# Altium schematic sheet AFE_DRL.SchDoc
size A4; SheetNumber: 2; SheetTotal: 3
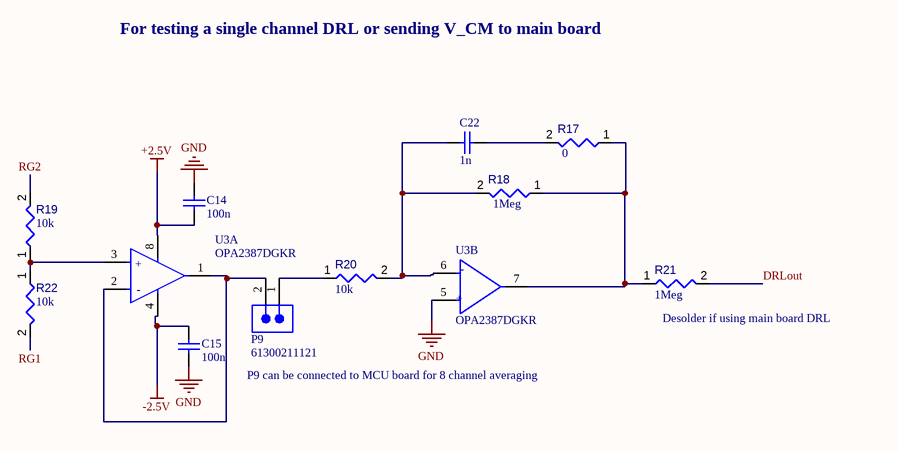
[diagram p0: AFE_DRL.SchDoc]

## Parts
C14  100n  [WCAP-CSGP_0402_L1W0.5H0.5]
C15  100n  [WCAP-CSGP_0402_L1W0.5H0.5]
C22  1n  [WCAP-CSGP_0402_L1W0.5H0.5]
P9  61300211121  [61300211121]
R17  value 0  [RESC1005X40X25ML05T05]  (hidden comment: Resistor 4k7 +/-1% 0402 63 mW)
R18  value 1Meg  [RESC1005X40X25ML05T05]  (hidden comment: Resistor 4k7 +/-1% 0402 63 mW)
R19  value 10k  [RESC1005X40X25ML05T05]  (hidden comment: Resistor 4k7 +/-1% 0402 63 mW)
R20  value 10k  [RESC1005X40X25ML05T05]  (hidden comment: Resistor 4k7 +/-1% 0402 63 mW)
R21  value 1Meg  [RESC1005X40X25ML05T05]  (hidden comment: Resistor 4k7 +/-1% 0402 63 mW)
R22  value 10k  [RESC1005X40X25ML05T05]  (hidden comment: Resistor 4k7 +/-1% 0402 63 mW)
U3  OPA2387DGKR  [FP-DGK0008A-IPC_B]  (parts A,B of 2)

## Nets
+2.5V: C14.1 U3.8(V+)
-2.5V: C15.2 U3.4(V-)
GND: C14.2 C15.1 U3.5(+IN_B)
DRLout: R21.2
RG1: R22.2
RG2: R19.2
NetC22_1: C22.1 R17.2
NetC22_2: C22.2 R18.2 R20.2 U3.6(-IN_B)
NetP9_1: P9.1 R20.1
NetP9_2: P9.2 U3.1(OUT_A) U3.2(-IN_A)
NetR17_1: R17.1 R18.1 R21.1 U3.7(OUT_B)
NetR19_1: R19.1 R22.1 U3.3(+IN_A)

## Notes on the sheet
- For testing a single channel DRL or sending V_CM to main board
- (near R21) Desolder if using main board DRL
- P9 can be connected to MCU board for 8 channel averaging
- (in symbol CMP-04895-000402-1, part A) +; -
- (in symbol CMP-04895-000402-1, part B) -; +

## Library data of the parts
C14 C15 C22 = CMP-207839-000017-2: CAP CER 10000PF 50V X7R 0402; NexarPartId: 53703204; Insulation Resistance: 10GΩ; Material: Ceramic; Tolerance: 10%; Capacitance: 10nF; Packaging: Tape & Reel (TR); Voltage Rating: 50V; Thickness: 558.8µm; Case Code (Imperial): 0402; Dielectric: X7R; Mount: Surface Mount; Width: 500µm; Height: 500µm; Min Operating Temperature: -55°C; Case/Package: 0402; RoHS: Compliant; Case Code (Metric): 1005; REACH SVHC: Unknown; Max Operating Temperature: 125°C; Voltage Rating (DC): 50V; Length: 1mm
P9 = CMP-1712-00002-6: NexarPartId: 20081794; Number of Contacts: 2; Pitch: 2.54mm; Connector Type: Male Pin; Voltage Rating: 250V; Current Rating: 3A; Gender: Male; Contact Resistance: 20mΩ; Height: 8.94mm; Lead Free: Lead Free; Number of Pins: 2; Termination: Through Hole; RoHS: Compliant; Lead Pitch: 2.54mm; REACH SVHC: No SVHC; Housing Material: PBT; Contact Mating Length: 5.9944mm; Min Operating Temperature: -40°C; Orientation: Vertical; Contact Material: Copper; Contact Gender: Male; Max Operating Temperature: 125°C; Number of Rows: 1; Number of Positions: 2; Packaging: Bulk; Contact Plating: Gold; Mount: Through Hole; Color: Black; Operating Supply Voltage: 250V
R17-R22 = CMP-009-00034-5: Chip Resistor, 4.7 KOhm, +/- 1%, 63 mW, -55 to 155 degC, 0402 (1005 Metric); Power: 63mW; Voltage Rating: 50V; Case/Package: 0402; Tolerance: 1%; Max Operating Temperature: 155°C; Pins: 2; RoHS Compliant: True; Min Operating Temperature: -55°C; Mounting Technology: SM
U3 = CMP-04895-000402-1: ULTRA-HIGH PRECISION, ZERO-DRIFT